# Altium schematic sheet connector.SchDoc
size A4; SheetNumber: 3; SheetTotal: 4
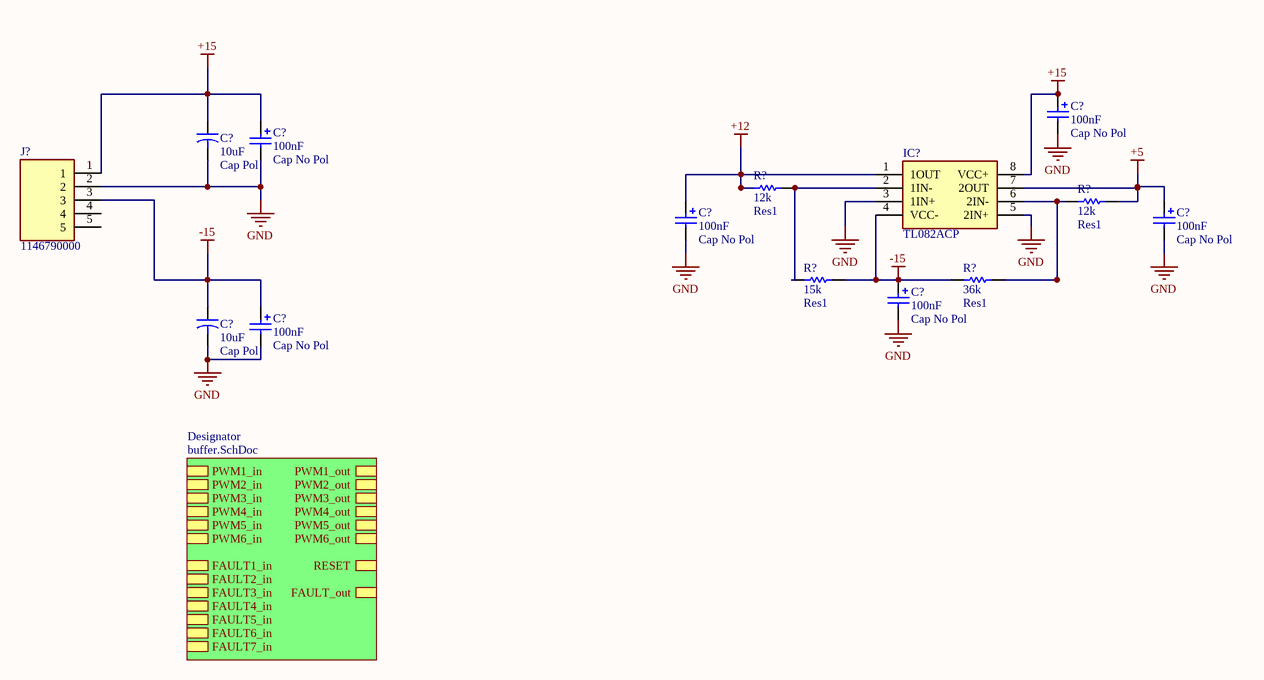
[diagram p0: connector.SchDoc]

## Parts
(Parts that share a designator on the sheet are numbered #1, #2 ... from top to bottom, then left to right.)
C?#1  Cap No Pol  value 100nF  [RAD-0.1]
C?#2  Cap Pol  value 10uF  [CAPR5-4X5]
C?#3  Cap No Pol  value 100nF  [RAD-0.1]
C?#4  Cap No Pol  value 100nF  [RAD-0.1]
C?#5  Cap No Pol  value 100nF  [RAD-0.1]
C?#6  Cap No Pol  value 100nF  [RAD-0.1]
C?#7  Cap Pol  value 10uF  [CAPR5-4X5]
C?#8  Cap No Pol  value 100nF  [RAD-0.1]
IC?  TL082ACP  [DIP794W53P254L959H508Q8N]
J?  1146790000  [1146790000]
R?#1  Res1  value 12k  [AXIAL-0.3]
R?#2  Res1  value 12k  [AXIAL-0.3]
R?#3  Res1  value 15k  [AXIAL-0.3]
R?#4  Res1  value 36k  [AXIAL-0.3]

## Sub-sheets
Designator = buffer.SchDoc: PWM1_in, PWM2_in, PWM3_in, PWM4_in, PWM5_in, PWM6_in, FAULT1_in, FAULT2_in, FAULT3_in, FAULT4_in, FAULT5_in, FAULT6_in, FAULT7_in, PWM1_out, PWM2_out, PWM3_out, PWM4_out, PWM5_out, PWM6_out, RESET, FAULT_out

## Nets
+5: C?#5.1 IC?.7(2OUT) R?#2.2
+12: C?#4.1 IC?.1(1OUT) R?#1.1
+15: C?#1.1 C?#2.1 C?#3.1 IC?.8(VCC+) J?.1
-15: C?#6.1 C?#7.1 C?#8.1 IC?.4(VCC-) J?.3 R?#3.2 R?#4.1
GND: C?#1.2 C?#2.2 C?#3.2 C?#4.2 C?#5.2 C?#6.2 C?#7.2 C?#8.2 IC?.3(1IN+) IC?.5(2IN+) J?.2
NetIC?_2: IC?.2(1IN-) R?#1.2 R?#3.1
NetIC?_6: IC?.6(2IN-) R?#2.1 R?#4.2

Not connected (* = marked no-connect by the designer): J? 4 5

## Library data of the parts
C?#1 C?#3-C?#6 C?#8 = Cap No Pol: Polarized Capacitor (Radial); Published: 8-Jun-2000; LatestRevisionDate: 17-Jul-2002; LatestRevisionNote: Re-released for DXP Platform.; PackageReference: RB7.6-15; Publisher: Altium Limited; PackageDescription: Polarized Capacitor (Radial); 2 Leads
C?#2 C?#7 = Cap Pol: Capacitor; Published: 23-Sep-2002; PackageReference: CAPR5-4X5; Publisher: Altium Limited; PackageDescription: Capacitor; 2 Leads
IC? = TL082ACP: Integrated Circuit; Manufacturer_Name: Texas Instruments; Datasheet Link: http://www.ti.com/lit/ds/symlink/tl081a.pdf; Height: 5.08mm; Manufacturer_Part_Number: TL082ACP; Mouser Part Number: 595-TL082ACP; Mouser Price/Stock: https://www.mouser.co.uk/ProductDetail/Texas-Instruments/TL082ACP?qs=0le1rQK8zxrLXibbSNmvcA%3D%3D; Arrow Part Number: TL082ACP; Arrow Price/Stock: https://www.arrow.com/en/products/tl082acp/texas-instruments?utm_currency=USD&region=nac
J? = 1146790000: Connector; Manufacturer_Name: Weidmuller; Datasheet Link: http://catalog.weidmueller.com/createDatasheetForMobile.do?ordernumber=1146790000&scope1=1&scope2=1&localeId=en; Height: 8.4mm; Manufacturer_Part_Number: 1146790000
R?#1-R?#4 = Res1: Resistor; Published: 8-Jun-2000; LatestRevisionDate: 17-Jul-2002; LatestRevisionNote: Re-released for DXP Platform.; PackageReference: AXIAL-0.3; Publisher: Altium Limited; PackageDescription: Axial Device, Thru-Hole; 2 Leads; 0.3 in Pin Spacing